# EasyEDA Pro project V reduction module.eprj

# Schematic Schematic1
Board Name: Board1; Create Date: 2024-09-23
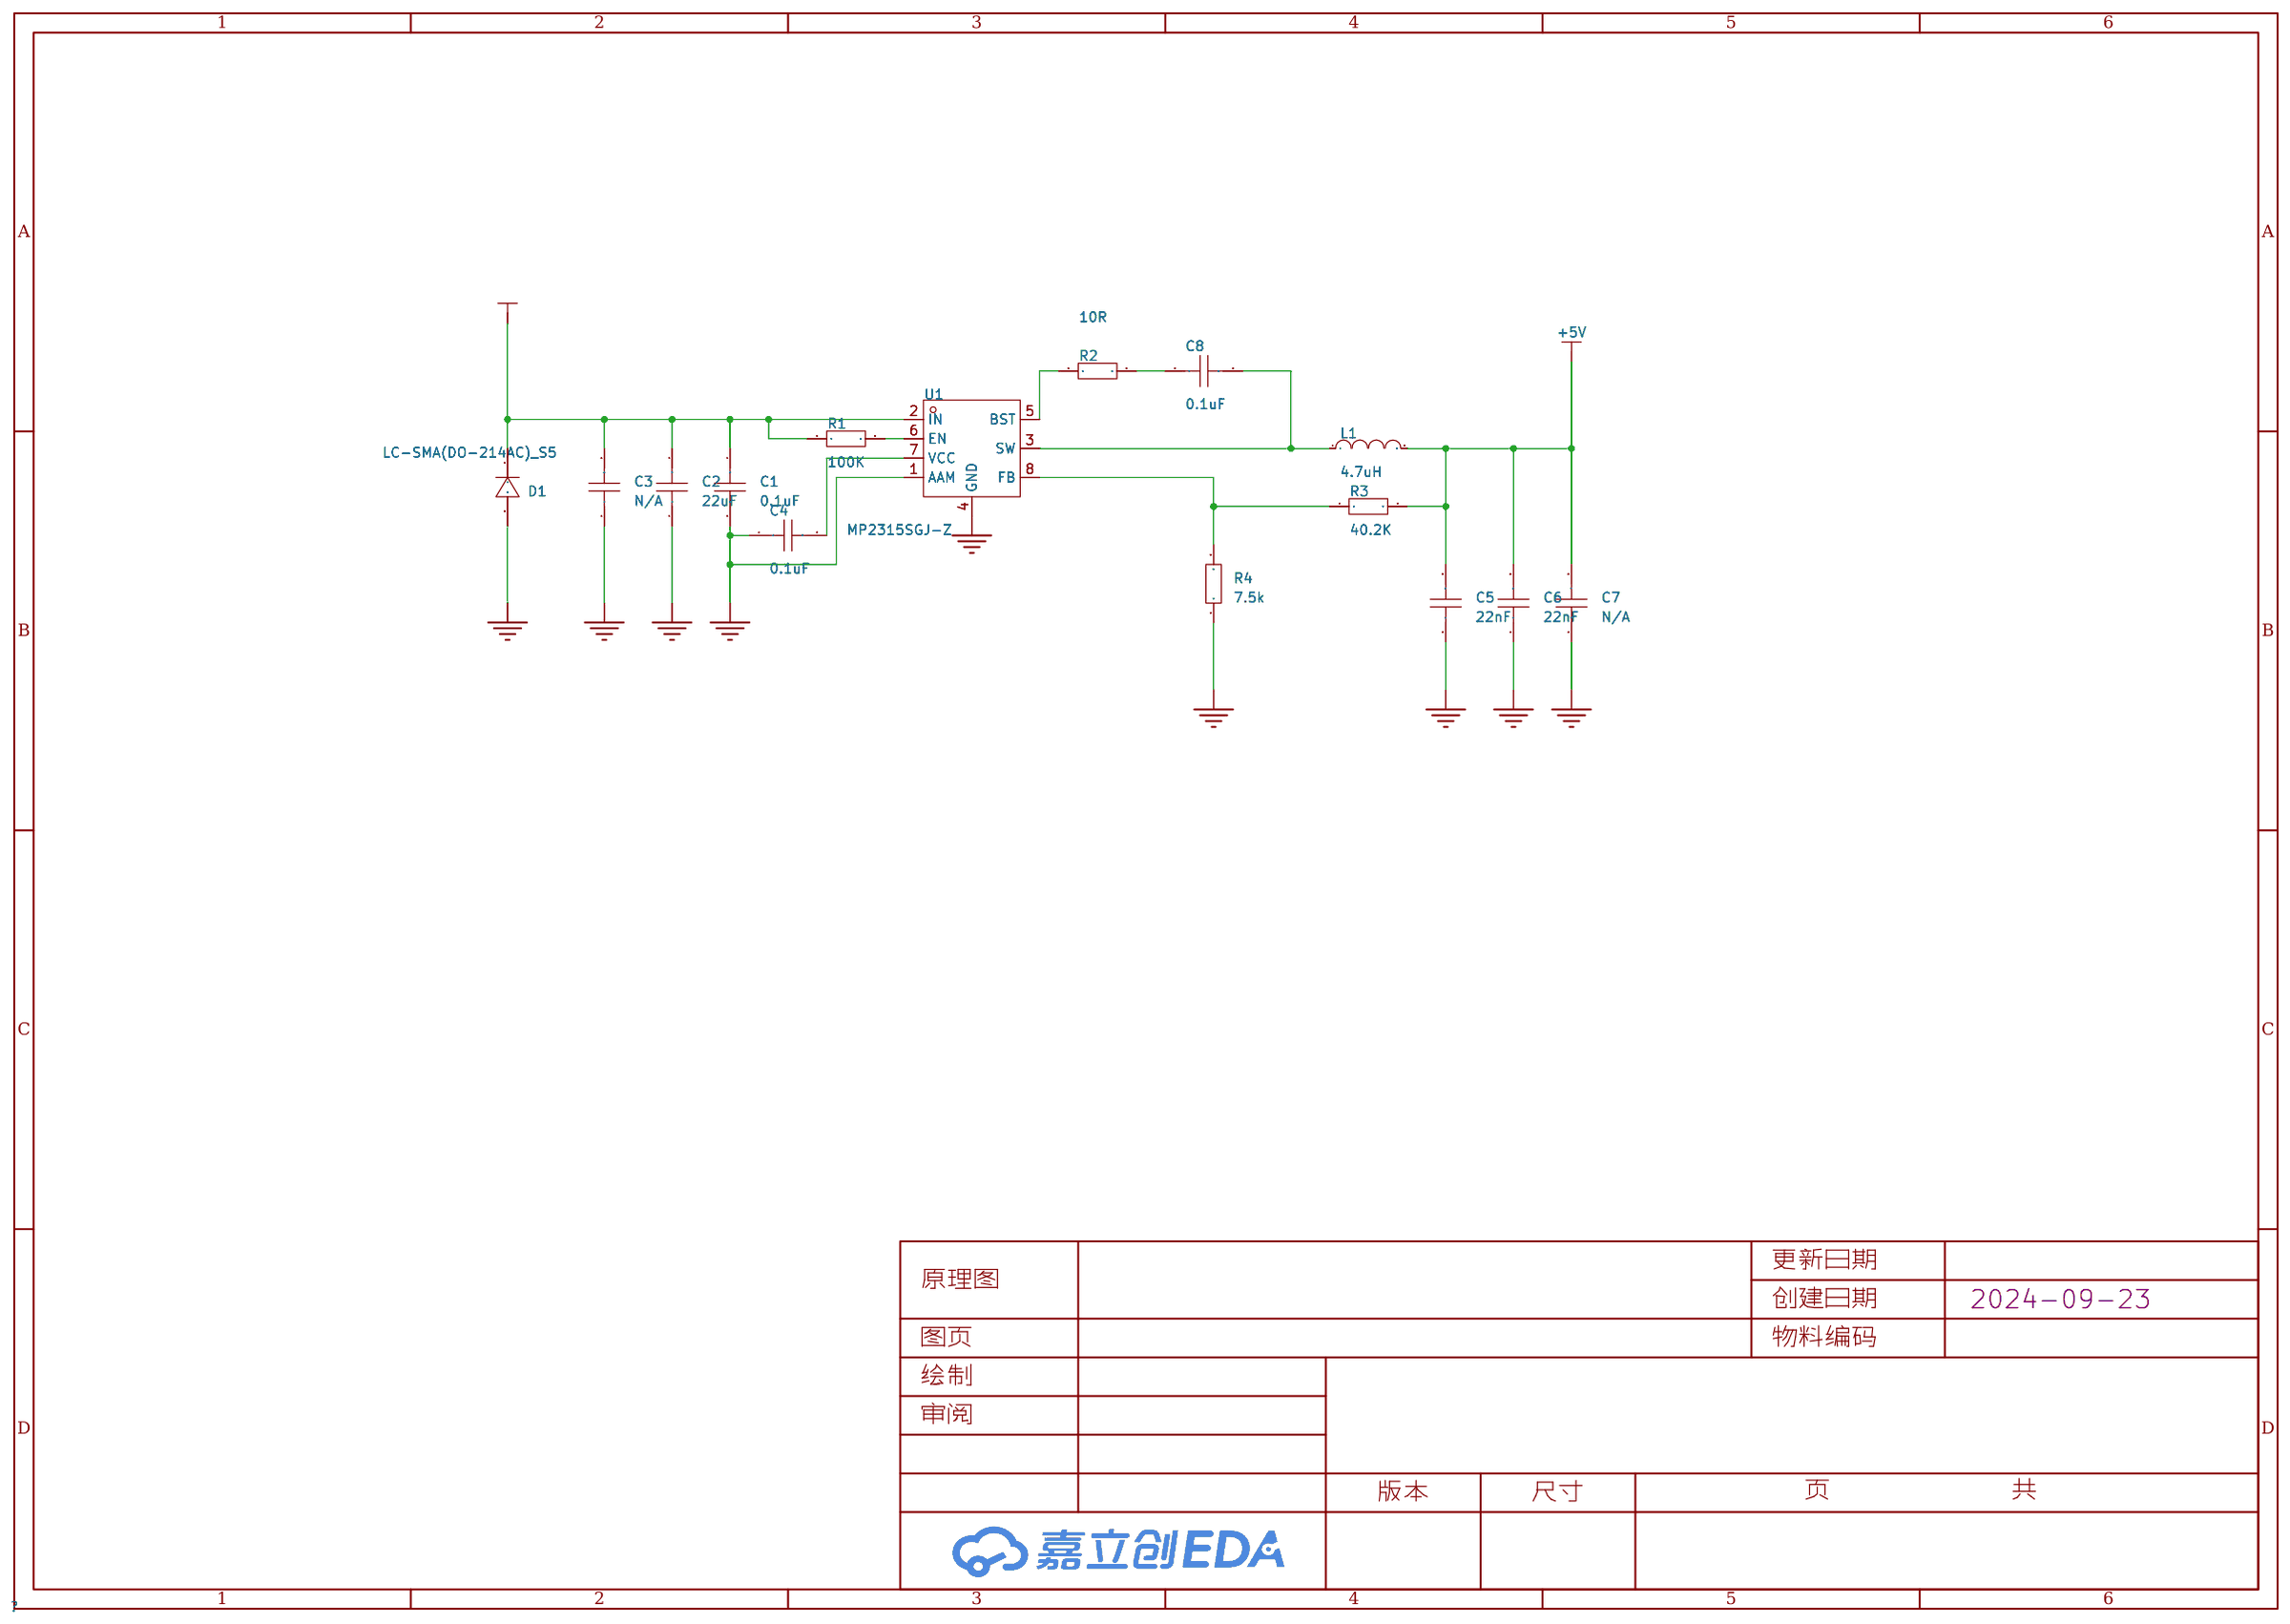
[diagram p0: schematic sheet]

## Parts
C1  22uF  [C1210]
C2  22uF  [C0603]
C3  100nF  [C0603]
C4  0.1uF  [C0603]
C5  22nF  [C0603]
C6  22nF  [C0603]
C7  N/A  [C0603]
C8  0.1uF  [C0603]
D1  LC-SMA(DO-214AC)_S5  [SMA_L4.3-W2.7-LS5.1-RD]
L1  4.7uH  [L0603]
R1  10K  [R0603]
R2  10R  [R0603]
R3  40.2K  [R0603]
R4  7.5k  [R0603]
U1  MP2315SGJ-Z  [TSOT-23-8_L2.9-W1.6-P0.65-LS2.8-BL]

## Library data of the parts
C1 = HGC1210R5226M350NSVK: LCSC Part Name: 22uF ±20% 35V; Supplier Part: C33546015; Manufacturer: Chinocera(华瓷); Supplier Footprint: 1210; JLCPCB Part Class: 扩展库; Datasheet: https://atta.szlcsc.com/upload/public/pdf/source/20240724/7749F3690BCC21BF5565A9D339ADF00C.pdf; Supplier: LCSC; Tolerance: ±20%; Voltage Rated: 35V; Temperature Coefficient: X5R
C2-C8 = CAP_0603: Supplier Footprint: 0603
D1 = LC-SMA(DO-214AC)_S5: Supplier Part: C9900003501; Supplier Footprint: SMAJ12A; JLCPCB Part Class: 扩展库; Supplier: LCSC
L1 = L_0603
R1-R4 = Res_0603: Supplier Footprint: 0603
U1 = MP2315SGJ-Z: Supplier Part: C3031493; Manufacturer: MPS(芯源); Supplier Footprint: TSOT-23-8; JLCPCB Part Class: 扩展库; Supplier: LCSC; Function: 降压型; Output Type: 可调; Input Voltage: 4.5V~24V; Output Voltage: 800mV~22.8V; Output Current: 3A; Switching Frequency: 500kHz; Operating Temperature: -40℃~+125℃@(TJ); Synchronous Rectification: 是; Number of Outputs: 1; Topology: 降压式; Switch tube (built-in/external): 内置

## Nets
+5V: C5.2 C6.2 C7.2 L1.2 R3.2
+24V: C1.1 C2.2 C3.2 D1.1 R1.1 U1.2(IN)
GND: C1.2 C2.1 C3.1 C4.1 C5.1 C6.1 C7.1 D1.2 R4.1 U1.1(AAM) U1.4(GND)
$1N705: R1.2 U1.6(EN)
$1N1477: C8.2 L1.1 U1.3(SW)
$1N1718: R2.1 U1.5(BST)
$1N1723: C8.1 R2.2
Net-(C4-2): C4.2 U1.7(VCC)
Net-(R3-1): R3.1 R4.2 U1.8(FB)

# Board PCB1
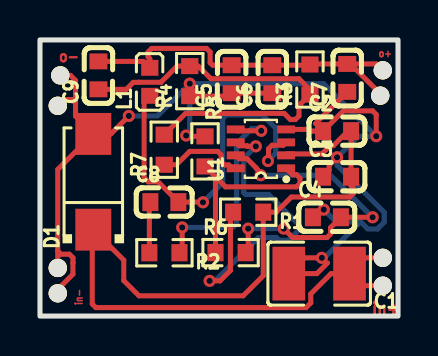
[diagram p1: board, top side]
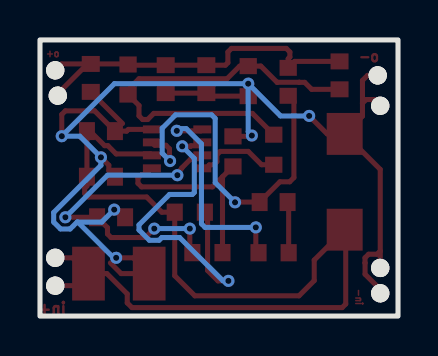
[diagram p2: board, bottom side, seen from below]

Outline 17.91 x 13.84 mm; copper layers: Top Layer, Bottom Layer. Coordinates in mm from the lower left corner of the outline.
Outline path: rectangle 0,13.84 17.91,0
Stack: Top Layer 0.035mm / Dielectric1 1.51mm FR4 er 4.5 / Bottom Layer 0.035mm

## Design rules (mm)
template: JLCPCB Capability(Two Layers Board)
spacing copperThickness1oz (default): track to track 0.102, other pairs 0.152 to 0.3
spacing copperThickness2oz: track to track 0.203, other pairs 0.152 to 0.3
track width copperThickness1oz (default): min 0.127, default 0.254, max 2.54
track width copperThickness2oz: min 0.203, default 0.254, max 2.54
differential pair differentialPair (default): width min 0.127, default 0.254, max 2.54; gap min 0.152, default 0.152
via viaSize (default): diameter min 0.5, default 0.61, max 10; hole min 0.3, default 0.305, max 6.3

## Placement (name value [footprint] x y rotation side)
C1  22uF  [C1210]  13.96 2.13 180 top
C2  22uF  [C0603]  14.86 9.27 0 top
C3  100nF  [C0603]  14.86 6.98 0 top
C4  0.1uF  [C0603]  14.35 4.95 0 top
C5  22nF  [C0603]  9.59 11.88 90 top
C6  22nF  [C0603]  11.62 11.88 90 top
C7  N/A  [C0603]  15.37 11.94 90 top
C8  0.1uF  [C0603]  6.22 5.71 0 top
C9  33pF  [C0603]  2.92 12.07 90 top
D1  LC-SMA(DO-214AC)_S5  [SMA_L4.3-W2.7-LS5.1-RD]  2.67 6.73 90 top
L1  4.7uH  [L0603]  5.49 11.74 90 top
NOREF  -  [Pad_e31]  0.89 10.54 0 top
NOREF#2  -  [Pad_e20]  17.15 2.92 0 top
NOREF#3  -  [Pad_e40]  0.89 1.14 0 top
NOREF#4  -  [Pad_e54]  17.15 12.32 0 top
NOREF#5  -  [Pad_e72]  17.02 11.05 0 top
NOREF#6  -  [Pad_e39]  0.89 2.41 0 top
NOREF#7  -  [Pad_e24]  17.15 1.52 0 top
NOREF#8  -  [Pad_e30]  1.02 12.06 0 top
R1  10K  [R0603]  10.41 5.21 180 top
R2  10R  [R0603]  6.22 3.17 180 top
R3  40.2K  [R0603]  13.5 11.86 90 top
R4  7.5k  [R0603]  7.49 11.78 90 top
R5  9.09K  [R0603]  8.25 8.26 270 top
R6  100K  [R0603]  9.53 3.18 0 top
R7  20K  [R0603]  6.22 8.34 90 top
U1  MP2315SGJ-Z  [TSOT-23-8_L2.9-W1.6-P0.65-LS2.8-BL]  11.05 8.38 90 top

## Footprints (pads in the part's own frame, mm; a bottom-side part is the same pattern mirrored in y, then rotated)
C0603
  rect 0.8x0.9 smd: 1(-0.7,0) 2(0.7,0)
C1210
  rect 1.635x2.7 smd: 1(-1.518,0) 2(1.518,0)
L0603
  rect 0.8x0.864 smd: 1(-0.7,0) 2(0.7,0)
Pad_e20
  round 0.914 hole 0.914: 1(0,0)
Pad_e24
  round 0.914 hole 0.914: 1(0,0)
Pad_e30
  round 0.914 hole 0.914: 1(0,0)
Pad_e31
  round 0.914 hole 0.914: 2(0,0)
Pad_e39
  round 0.914 hole 0.914: 1(0,0)
Pad_e40
  round 0.914 hole 0.914: 2(0,0)
Pad_e54
  round 0.914 hole 0.914: 1(0,0)
Pad_e72
  round 0.914 hole 0.914: 2(0,0)
R0603
  rect 0.806x0.864 smd: 1(-0.753,0) 2(0.753,0)
SMA_L4.3-W2.7-LS5.1-RD
  rect 2.1x1.8 smd: 1(-2.4,0) 2(2.4,0)
TSOT-23-8_L2.9-W1.6-P0.65-LS2.8-BL
  rect 0.4x0.9 smd: 1(-0.975,-1.26) 2(-0.325,-1.26) 3(0.325,-1.26) 4(0.975,-1.26) 5(0.975,1.26) 6(0.325,1.26) 7(-0.325,1.26) 8(-0.975,1.26)

## Nets
24V: C1.1 C2.2 C3.2 D1.1 NOREF#2.1 NOREF#7.1 R1.1 U1.2
+5V: C5.2 C6.2 C7.2 C9.2 L1.2 NOREF#4.1 NOREF#5.2 R3.2
GND: C1.2 C2.1 C3.1 C4.1 C5.1 C6.1 C7.1 D1.2 NOREF.2 NOREF#3.2 NOREF#6.1 NOREF#8.1 R4.1 R5.1 U1.4
$1N705: R1.2 U1.6
$1N1295: C4.2 R6.2 U1.7
$1N1477: C8.2 L1.1 U1.3
$1N1718: R2.1 U1.5
$1N1723: C8.1 R2.2
$1N2036: R5.2 R6.1 U1.1
$1N2155: R7.1 U1.8
$1N2161: C9.1 R3.1 R4.2 R7.2

## Via types
v1: diameter 0.61, hole 0.305, Top Layer to Bottom Layer, 17 vias

## Routing (per net, layer and track width the routed paths; a pad name or vN(x,y) marks a point on that pad's centre or on a via; arc(x,y) is an arc through that point)
24V: length 47.5
  Top Layer w0.254: NOREF#2.1 16.27,2.92 C1.1 ; C1.1 16.09,1.52 NOREF#7.1 ; C1.1 14.56,2.13 13.54,1.11 13.54,0.66 13.31,0.43 2.79,0.43 2.61,0.61 2.61,4.28 D1.1 4.19,2.81 4.19,1.78 4.95,1.02 10.16,1.02 11.17,2.02 R1.1 11.81,5.21 12.57,5.97 15.49,5.97 15.67,6.15 15.67,6.4 15.56,6.52 C3.2 C2.2 15.4,9.27 14.67,8.54 14.51,8.54 14.1,8.13 12.38,8.13 U1.2
+5V: length 18.3
  Top Layer w0.254: 15.53,12.64 C7.2 13.53,12.64 R3.2 13.47,12.58 C6.2 C5.2 8.63,12.58 8.51,12.7 8.51,13.24 8.33,13.42 5.59,13.42 5.41,13.24 5.41,12.98 5.49,12.9 L1.2 5.17,12.77 C9.2 ; 15.53,12.64 16.83,12.64 NOREF#4.1 ; 15.53,12.64 17.02,11.15
GND: length 67.7
  Top Layer w0.254: C7.1 13.78,9.65 ; v1(16.82,9.02) 16.82,10.11 16.64,10.29 15.18,10.29 C2.1 13.57,9.27 13.49,9.36 U1.4 ; 0.89,0.97 0.89,1.34 1.65,2.1 1.65,2.66 1.65,2.67 1.65,2.92 1.47,3.1 1.05,3.1 0.89,3.26 ; v1(7.31,9.05) 7.35,9.01 R5.1 ; 0.89,3.26 0.89,7.35 D1.2 ; 0.89,3.26 NOREF#6.1 ; 14.38,2.67 13.85,2.13 C1.2 13.24,2.92 v1(14.1,2.92) ; 1.78,10.67 1.78,11.81 1.52,12.06 NOREF#8.1 ; 1.78,10.67 1.59,10.85 1.2,10.85 NOREF.2 ; 1.78,10.67 1.78,10.02 D1.2 ; D1.2 3.54,9.13 v1(4.44,10.03) ; C3.1 14.46,7.29 14.46,7.56 v1(14.86,7.96) ; C6.1 C5.1 9.43,11.02 R4.1 v1(7.49,11.65) ; v1(14.19,5.34) 13.81,4.95 C4.1
  Bottom Layer w0.254: 16.01,4.71 14.82,4.71 v1(14.19,5.34) ; 16.01,4.71 14.22,2.92 v1(14.1,2.92) ; 16.01,4.71 16.05,4.71 16.4,4.37 16.88,4.37 17.22,4.71 17.22,5.2 14.86,7.56 v1(14.86,7.96) 15.92,9.02 v1(16.82,9.02) 14.18,11.65 v1(7.49,11.65) ; v1(7.31,9.05) 7.49,9.23 v1(7.49,11.65) ; v1(4.44,10.03) 5.88,10.03 v1(7.49,11.65)
$1N705: length 17
  Top Layer w0.254: R1.2 9.53,5.07 9.53,2.29 9,1.77 v1(8.48,1.77) ; v1(10.8,8.51) 10.38,8.51 10.35,8.54 9.96,8.54 U1.6
  Bottom Layer w0.254: 10.67,8.38 10.19,7.9 10.19,6.2 10.29,6.1 11.43,6.1 12.95,4.57 12.95,4.32 12.43,3.8 11.95,3.8 11.81,3.94 10.92,3.94 8.75,1.77 v1(8.48,1.77)
$1N1295: length 16.5
  Top Layer w0.254: R6.2 10.41,3.31 v1(10.41,4.38) ; v1(12.19,4.38) 12.64,3.94 14.35,3.94 14.53,4.12 14.53,4.43 C4.2 v1(16.64,4.95) ; v1(11.04,7.06) 11.04,7.19 10.82,7.4 10.82,7.42 10.35,7.89 9.96,7.89 U1.7
  Bottom Layer w0.254: v1(11.04,7.06) 14.53,7.06 v1(16.64,4.95) ; v1(10.41,4.38) v1(12.19,4.38)
$1N1477: length 18.5
  Top Layer w0.254: v1(11.4,7.77) 11.43,7.8 11.43,8.38 11.61,8.56 12.16,8.56 U1.3 ; L1.1 5.21,10.76 5.21,6.94 5.42,6.73 5.91,6.73 C8.2 7.87,5.71
  Bottom Layer w0.254: v1(11.4,7.77) 11.79,8.16 11.79,9.42 11.12,10.09 9.32,10.09 9.14,9.91 9.14,6.69 v1(8.15,5.7)
$1N1718: length 10.8
  Top Layer w0.254: v1(11.06,9.29) 9.86,9.29 U1.5 ; R2.1 7.11,3.31 7.11,4.19
  Bottom Layer w0.254: v1(11.06,9.29) 10.95,9.4 10.59,9.4 9.83,8.64 9.83,4.63 9.65,4.45 v1(7.11,4.45)
$1N1723: length 2.6
  Top Layer w0.254: R2.2 5.47,5.66 5.52,5.71
$1N2036: length 10.2
  Top Layer w0.254: 8.78,6.98 9.28,6.48 12.83,6.48 13.01,6.66 13.01,6.91 12.83,7.09 12.63,7.09 U1.1 ; 8.78,6.98 R6.1 ; 8.78,6.98 R5.2
$1N2155: length 4.4
  Top Layer w0.254: R7.1 6.82,7.59 7.49,8.26 8.89,8.26 9.06,8.09 9.06,7.74 9.22,7.58 9.44,7.58 9.61,7.41 U1.8
$1N2161: length 20.5
  Top Layer w0.254: C9.1 4.32,11.37 4.67,11.72 4.94,11.72 4.94,11.72 6.04,11.72 6.05,11.72 6.86,12.53 R4.2 7.92,12.53 8.55,11.9 12.95,11.9 13.5,11.35 R3.1 12.95,10.56 12.95,10.03 12.77,9.85 12.52,9.85 12.21,10.16 7.28,10.16 R7.2

## Text on the board
Top Layer: o+ | in- | o- | in+

# Board PCB1_1
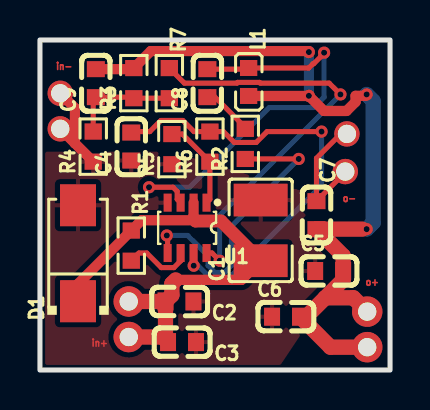
[diagram p3: board, top side]
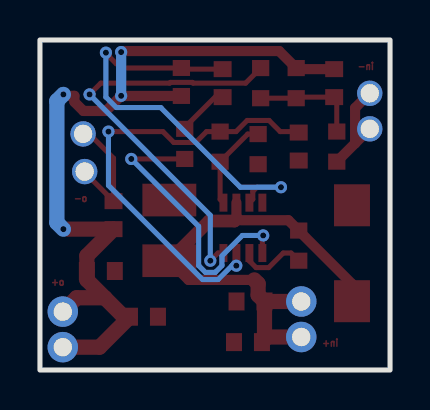
[diagram p4: board, bottom side, seen from below]

Outline 17.53 x 16.51 mm; copper layers: Top Layer, Bottom Layer. Coordinates in mm from the lower left corner of the outline.
Outline path: rectangle 0,16.51 17.53,0
Stack: Top Layer 0.035mm / Dielectric1 1.51mm FR4 er 4.5 / Bottom Layer 0.035mm

## Design rules (mm)
template: JLCPCB Capability(Two Layers Board)
spacing copperThickness1oz (default): track to track 0.102, other pairs 0.152 to 0.3
spacing copperThickness2oz: track to track 0.203, other pairs 0.152 to 0.3
track width copperThickness1oz (default): min 0.127, default 0.254, max 2.54
track width copperThickness2oz: min 0.203, default 0.254, max 2.54
differential pair differentialPair (default): width min 0.127, default 0.254, max 2.54; gap min 0.152, default 0.152
via viaSize (default): diameter min 0.5, default 0.61, max 10; hole min 0.3, default 0.305, max 6.3

## Placement (name value [footprint] x y rotation side)
C1  22uF  [C1210]  11.05 6.98 90 top
C2  22uF  [C0603]  6.98 3.43 180 top
C3  -  [C0603]  7.11 1.4 180 top
C4  0.1uF  [C0603]  4.57 11.18 90 top
C5  0.1uF  [C0603]  14.48 4.95 0 top
C6  22nF  [C0603]  12.32 2.67 0 top
C7  N/A  [C0603]  13.84 7.75 270 top
C8  0.1uF  [C0603]  8.38 14.35 90 top
C9  33pF  [C0603]  2.8 14.35 90 top
D1  LC-SMA(DO-214AC)_S5  [SMA_L4.3-W2.7-LS5.1-RD]  1.91 5.84 90 top
L1  4.7uH  [L0603]  10.45 14.41 270 top
NOREF  -  [Pad_e262]  15.37 11.81 0 top
NOREF#2  -  [Pad_e772]  4.44 1.65 0 top
NOREF#3  -  [Pad_e773]  4.44 3.43 0 top
NOREF#4  -  [Pad_e775]  16.38 2.92 0 top
NOREF#5  -  [Pad_e263]  15.29 9.93 0 top
NOREF#6  -  [Pad_e776]  16.38 1.14 0 top
NOREF#7  -  [Pad_e66]  1.02 13.84 0 top
NOREF#8  -  [Pad_e67]  1.02 12.06 0 top
R1  -  [R0603]  4.57 6.22 270 top
R2  10R  [R0603]  10.28 11.31 90 top
R3  40.2K  [R0603]  4.7 14.35 90 top
R4  7.5k  [R0603]  2.67 11.18 90 top
R5  9.09K  [R0603]  6.6 11.05 90 top
R6  100K  [R0603]  8.51 11.17 90 top
R7  20K  [R0603]  6.48 14.35 270 top
U1  MP2315SGJ-Z  [TSOT-23-8_L2.9-W1.6-P0.65-LS2.8-BL]  7.37 7.11 180 top

## Footprints (pads in the part's own frame, mm; a bottom-side part is the same pattern mirrored in y, then rotated)
C0603
  rect 0.8x0.9 smd: 1(-0.7,0) 2(0.7,0)
C1210
  rect 1.635x2.7 smd: 1(-1.518,0) 2(1.518,0)
L0603
  rect 0.8x0.864 smd: 1(-0.7,0) 2(0.7,0)
Pad_e66
  round 1.27 hole 0.914: 1(0,0)
Pad_e67
  round 1.27 hole 0.914: 2(0,0)
Pad_e262
  round 1.27 hole 0.914: 1(0,0)
Pad_e263
  round 1.27 hole 0.914: 2(0,0)
Pad_e772
  round 1.524 hole 0.914: 1(0,0)
Pad_e773
  round 1.524 hole 0.914: 2(0,0)
Pad_e775
  round 1.524 hole 0.914: 1(0,0)
Pad_e776
  round 1.524 hole 0.914: 2(0,0)
R0603
  rect 0.806x0.864 smd: 1(-0.753,0) 2(0.753,0)
SMA_L4.3-W2.7-LS5.1-RD
  rect 2.1x1.8 smd: 1(-2.4,0) 2(2.4,0)
TSOT-23-8_L2.9-W1.6-P0.65-LS2.8-BL
  rect 0.4x0.9 smd: 1(-0.975,-1.26) 2(-0.325,-1.26) 3(0.325,-1.26) 4(0.975,-1.26) 5(0.975,1.26) 6(0.325,1.26) 7(-0.325,1.26) 8(-0.975,1.26)

## Nets
24V: C1.1 C2.2 C3.2 D1.1 NOREF#2.1 NOREF#3.2 R1.1 U1.2
+5V: C5.2 C6.2 C7.2 C9.2 L1.2 NOREF#4.1 NOREF#6.2 R3.2
GND: C1.2 C2.1 C3.1 C4.1 C5.1 C6.1 C7.1 D1.2 NOREF.1 NOREF#5.2 NOREF#7.1 NOREF#8.2 R4.1 R5.1 U1.4
$1N705: R1.2 U1.6
$1N1295: C4.2 R6.2 U1.7
$1N1477: C8.2 L1.1 U1.3
$1N1718: R2.1 U1.5
$1N1723: C8.1 R2.2
$1N2036: R5.2 R6.1 U1.1
$1N2155: R7.1 U1.8
$1N2161: C9.1 R3.1 R4.2 R7.2

## Via types
v1: diameter 0.61, hole 0.305, Top Layer to Bottom Layer, 12 vias

## Routing (per net, layer and track width the routed paths; a pad name or vN(x,y) marks a point on that pad's centre or on a via; arc(x,y) is an arc through that point)
24V: length 24.5
  Top Layer w0.254: 6.28,1.52 C3.2
  Top Layer w0.508: 7.69,7.69 U1.2 ; D1.1 1.91,4.31 R1.1 5.09,7.49 7.49,7.49 ; C1.1 10.09,4.51 6.79,4.51
  Top Layer w0.635: 7.68,7.56 7.79,7.45 9.06,7.45 C1.1
  Top Layer w0.762: NOREF#2.1 6.16,1.65 6.28,1.52 C2.2 ; C2.2 NOREF#3.2 ; C2.2 6.6,3.75 6.6,4.32 6.79,4.51
+5V: length 41.6
  Top Layer w0.508: L1.2 13.45,13.71 v1(13.46,13.72) 14.22,12.96 15.35,12.96 15.8,13.41 15.8,13.72 16.28,13.72 v1(16.35,13.79) ; v1(13.46,15.91) 13.41,15.96 5.55,15.96 R3.2 4.65,15.05 C9.2
  Top Layer w0.762: 14.28,3.61 15.69,3.61 NOREF#4.1 ; 14.28,3.61 15.18,4.51 C5.2 15.18,5.71 C7.2 16.13,7.05 ; 14.28,3.61 13.34,2.67 C6.2 14.54,1.14 16.26,1.14
  Bottom Layer w0.508: v1(13.46,13.72) v1(13.46,15.91)
  Bottom Layer w0.762: v1(16.35,7.05) 16.68,7.37 16.68,13.46 v1(16.35,13.79)
GND: length 11.4
  Top Layer w0.254: 15.29,12.04 13.84,10.6 C7.1 15.29,9.89 NOREF#5.2
  Top Layer w0.508: 1.75,11.34 1.04,12.05 1.02,12.05 ; 1.75,11.34 1.75,13.11 NOREF#7.1 ; 1.75,11.34 R4.1
$1N705: length 3.5
  Top Layer w0.254: U1.6 7.04,5.46 6.71,5.12 6.08,5.12 5.35,5.85 4.95,5.85 R1.2
$1N1295: length 22.4
  Top Layer w0.254: v1(7.7,5.22) 7.7,5.85 U1.7 ; 4.57,11.88 4.62,11.93 5.5,11.93 6.06,12.48 7.15,12.48 7.71,11.93 R6.2 9.19,11.93 9.73,11.38 10.83,11.38 11.37,11.93 v1(14.1,11.93)
  Bottom Layer w0.254: v1(7.7,5.22) 7.92,5.22 8.61,4.53 9.39,4.53 14.1,9.24 v1(14.1,11.93)
$1N1477: length 21.2
  Top Layer w0.254: v1(5.46,9.14) 6.66,9.14 6.87,8.94 6.87,8.54 U1.3 ; v1(14.22,15.88) 14.05,15.7 14.05,15.66 13.7,15.32 13.67,15.32 13.46,15.11 L1.1 10.39,15.05 C8.2
  Bottom Layer w0.254: v1(14.22,15.88) 14.22,13.65 13.7,13.13 11.48,13.13 7.49,9.14 v1(5.46,9.14)
$1N1718: length 14.7
  Top Layer w0.254: U1.5 6.39,6.69 v1(6.35,6.73) ; R2.1 v1(12.95,10.56)
  Bottom Layer w0.254: v1(6.35,6.73) 7.39,6.73 8.41,5.71 8.41,5.23 8.76,4.88 9.24,4.88 9.58,5.23 9.58,7.19 v1(12.95,10.56)
$1N1723: length 2.6
  Top Layer w0.254: R2.2 10.28,12.14 8.51,13.91
$1N2036: length 4.6
  Top Layer w0.254: 8.34,8.37 8.51,8.54 R6.1 7.13,11.8 R5.2
$1N2155: length 20.8
  Top Layer w0.254: v1(15.04,13.79) 14.48,14.35 11.03,14.35 10.99,14.39 9.9,14.39 9.86,14.35 7.23,14.35 R7.1 ; v1(9,5.47) 8.61,5.85 8.34,5.85
  Bottom Layer w0.254: v1(15.04,13.79) 9,7.74 v1(9,5.47)
$1N2161: length 5.5
  Top Layer w0.254: R4.2 2.67,13.52 C9.1 4.65,13.65 R3.1 R7.2

## Copper pours and planes (outline as drawn; the poured copper is in the pictures)
GND on Top Layer: 0.13,10.92 6.6,10.92 15.24,8.32 15.24,5.02 11.87,0 0.13,0

## Text on the board
Top Layer: in- | in+ | o- | o+
